# Altium schematic sheet Power.SchDoc
size A4
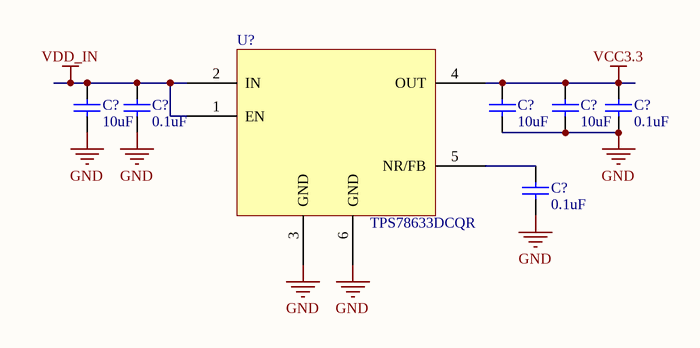
[diagram p0: Power.SchDoc]

## Parts
(Parts that share a designator on the sheet are numbered #1, #2 ... from top to bottom, then left to right.)
C?#1  10uF  [C0603]
C?#2  0.1uF  [C0603]
C?#3  10uF  [C0603]
C?#4  10uF  [C0603]
C?#5  0.1uF  [C0603]
C?#6  0.1uF  [C0603]
U?  TPS78633DCQR  [SOT-223-G6]

## Nets
GND: C?#1.1 C?#2.1 C?#3.1 C?#4.1 C?#5.1 C?#6.1 U?.3(GND) U?.6(GND)
VCC3.3: C?#3.2 C?#4.2 C?#5.2 U?.4(OUT)
VDD_IN: C?#1.2 C?#2.2 U?.1(EN) U?.2(IN)
NetC?#6_2: C?#6.2 U?.5(NR/FB)

## Notes on the sheet
- Labels drawn without touching a wire or pin: /, =Date, =DocumentName, =DocumentNumber, =Engineer, =ProjectName, =Revision, =SheetNumber, =Time, Checkedby：, Date：, DocumentName：, DocumentNumber/SheetNumber：, Engineer：, ProjectName：, Revision：, Time：

## Library data of the parts
C?#1 C?#2 C?#5 C?#6 = Cap: Capacitor; Published: 8-Jun-2000; LatestRevisionDate: 17-Jul-2002; LatestRevisionNote: Re-released for DXP Platform.; PackageReference: RAD-0.3; Publisher: Altium Limited; PackageDescription: Radial Cap, Thru-Hole; 2 Leads; 0.3 in Pin Spacing
  C?#1: Value: 10uF
  C?#2 C?#5 C?#6: Value: 0.1uF
C?#3 C?#4 = Cap: Capacitor,33uF / ESR 1.69m /10Vdc,C2012X5R1A336M125AC; Published: 8-Jun-2000; LatestRevisionDate: 17-Jul-2002; LatestRevisionNote: Re-released for DXP Platform.; PackageReference: RAD-0.3; Publisher: Altium Limited; PackageDescription: Radial Cap, Thru-Hole; 2 Leads; 0.3 in Pin Spacing; Value: 10uF
U? = TPS79633DCQR